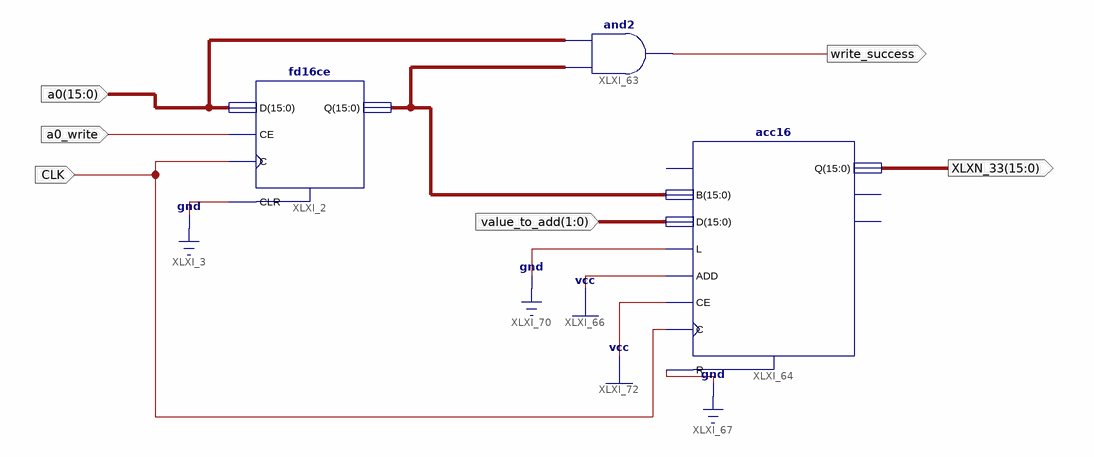
[diagram p0: schematic sheet 1]
// Xilinx ISE schematic top_level_schematic.sch (spartan3e) as structural Verilog: 3 symbols, 6 ports
module top_level_schematic (
  input  [15:0] a0,
  input  a0_write,
  input  CLK,
  input  [1:0] value_to_add,
  output write_success,
  output [15:0] XLXN_33
);

  wire [15:0] O;

  assign write_success = O & a0;  // and2 XLXI_63, 16 bits wide
  acc16 XLXI_64 (
    .ADD(1'b1), .B(O), .C(CLK), .CE(1'b1), .D(value_to_add), .L(1'b0), .R(1'b0), .Q(XLXN_33));  // open: CI, CO, OFL
  fd16ce XLXI_2 (.C(CLK), .CE(a0_write), .CLR(1'b0), .D(a0), .Q(O));
endmodule
